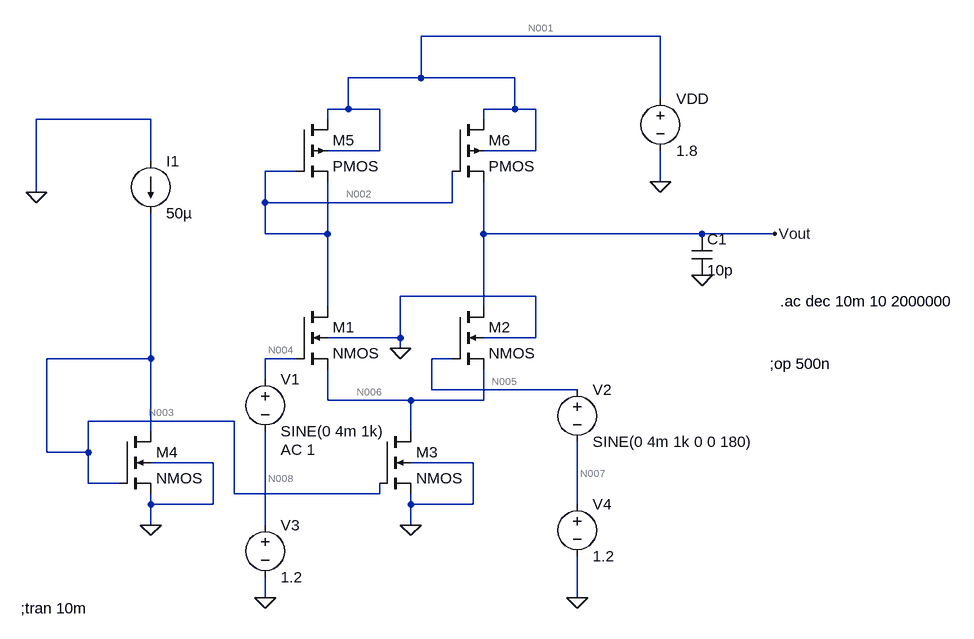
[diagram p0: schematic CMOS Differential Amplifier with Current Mirror Load.asc]
CMOS Differential Amplifier with Current Mirror Load.asc, the LTspice schematic file:
Version 4
SHEET 1 1136 680
WIRE 656 -224 288 -224
WIRE 288 -160 288 -224
WIRE 288 -160 176 -160
WIRE 432 -160 288 -160
WIRE 656 -128 656 -224
WIRE 176 -112 176 -160
WIRE 176 -112 144 -112
WIRE 224 -112 176 -112
WIRE 432 -112 432 -160
WIRE 432 -112 384 -112
WIRE 464 -112 432 -112
WIRE -128 -96 -304 -96
WIRE 144 -96 144 -112
WIRE 384 -96 384 -112
WIRE 224 -48 224 -112
WIRE 224 -48 144 -48
WIRE 464 -48 464 -112
WIRE 464 -48 384 -48
WIRE -128 -32 -128 -96
WIRE 96 -16 48 -16
WIRE 656 0 656 -48
WIRE -304 16 -304 -96
WIRE 48 32 48 -16
WIRE 336 32 336 -16
WIRE 336 32 48 32
WIRE 48 80 48 32
WIRE 144 80 144 0
WIRE 144 80 48 80
WIRE 384 80 384 0
WIRE 720 80 384 80
WIRE 832 80 720 80
WIRE 464 176 256 176
WIRE 144 192 144 80
WIRE 384 192 384 80
WIRE 256 240 256 176
WIRE 256 240 144 240
WIRE 464 240 464 176
WIRE 464 240 384 240
WIRE 256 256 256 240
WIRE -128 272 -128 48
WIRE -128 272 -288 272
WIRE 96 272 48 272
WIRE 336 272 304 272
WIRE 48 304 48 272
WIRE 304 320 304 272
WIRE 528 320 304 320
WIRE 144 336 144 288
WIRE 272 336 144 336
WIRE 384 336 384 288
WIRE 384 336 272 336
WIRE 0 368 -224 368
WIRE -128 384 -128 272
WIRE 272 384 272 336
WIRE -288 416 -288 272
WIRE -224 416 -224 368
WIRE -224 416 -288 416
WIRE -32 432 -128 432
WIRE 368 432 272 432
WIRE -224 464 -224 416
WIRE -176 464 -224 464
WIRE 0 480 0 368
WIRE 224 480 224 464
WIRE 224 480 0 480
WIRE -128 496 -128 480
WIRE -32 496 -32 432
WIRE -32 496 -128 496
WIRE 272 496 272 480
WIRE 368 496 368 432
WIRE 368 496 272 496
WIRE 528 496 528 400
WIRE -128 528 -128 496
WIRE 48 528 48 384
WIRE 272 528 272 496
WIRE 48 640 48 608
WIRE 528 640 528 576
FLAG 256 256 0
FLAG 656 0 0
FLAG -304 16 0
FLAG 528 640 0
FLAG 48 640 0
FLAG -128 528 0
FLAG 272 528 0
FLAG 720 144 0
FLAG 832 80 Vout
SYMBOL nmos4 96 192 R0
SYMATTR InstName M1
SYMATTR Value2 l=1u w=9u
SYMBOL nmos4 336 192 R0
SYMATTR InstName M2
SYMATTR Value2 l=1u w=9u
SYMBOL nmos4 224 384 R0
SYMATTR InstName M3
SYMATTR Value2 l=1u w=6u
SYMBOL nmos4 -176 384 R0
SYMATTR InstName M4
SYMATTR Value2 l=1u w=6u
SYMBOL pmos4 96 -96 R0
SYMATTR InstName M5
SYMATTR Value2 l=1u w=48u
SYMBOL pmos4 336 -96 R0
SYMATTR InstName M6
SYMATTR Value2 l=1u w=48u
SYMBOL voltage 48 288 R0
WINDOW 123 24 124 Left 2
WINDOW 39 0 0 Left 0
SYMATTR InstName V1
SYMATTR Value SINE(0 4m 1k)
SYMATTR Value2 AC 1
SYMBOL voltage 656 -144 R0
WINDOW 123 0 0 Left 0
WINDOW 39 0 0 Left 0
SYMATTR InstName VDD
SYMATTR Value 1.8
SYMBOL voltage 528 304 R0
WINDOW 123 0 0 Left 0
WINDOW 39 0 0 Left 0
SYMATTR InstName V2
SYMATTR Value SINE(0 4m 1k 0 0 180)
SYMBOL voltage 528 480 R0
WINDOW 123 0 0 Left 0
WINDOW 39 0 0 Left 0
SYMATTR InstName V4
SYMATTR Value 1.2
SYMBOL current -128 -32 R0
WINDOW 123 0 0 Left 0
WINDOW 39 0 0 Left 0
SYMATTR InstName I1
SYMATTR Value 50µ
SYMBOL voltage 48 512 R0
WINDOW 123 0 0 Left 0
WINDOW 39 0 0 Left 0
SYMATTR InstName V3
SYMATTR Value 1.2
SYMBOL cap 704 80 R0
SYMATTR InstName C1
SYMATTR Value 10p
TEXT -328 656 Left 2 !;tran 10m
TEXT 840 184 Left 2 !.ac dec 10m 10 2000000
TEXT 824 280 Left 2 !;op 500n

The netlist it stands for:
* CMOS Differential Amplifier with Current Mirror Load.asc
M1 N002 N004 N006 0 NMOS l=1u w=9u
M2 Vout N005 N006 0 NMOS l=1u w=9u
M3 N006 N003 0 0 NMOS l=1u w=6u
M4 N003 N003 0 0 NMOS l=1u w=6u
M5 N001 N002 N002 N001 PMOS l=1u w=48u
M6 N001 N002 Vout N001 PMOS l=1u w=48u
V1 N004 N008 SINE(0 4m 1k) AC 1
VDD N001 0 1.8
V2 N005 N007 SINE(0 4m 1k 0 0 180)
V4 N007 0 1.2
I1 0 N003 50µ
V3 N008 0 1.2
C1 Vout 0 10p
.model NMOS NMOS
.model PMOS PMOS
.lib standard.mos
;tran 10m
.ac dec 10m 10 2000000
;op 500n
.backanno
.end

* Results of the author's LTspice run, read from the files saved beside the schematic
* Operating Point, zero values left out:
*   V(n002) = 1.579 V
*   V(n004) = 1.2 V
*   V(n006) = 689 mV
*   V(vout) = 1.579 V
*   V(n005) = 1.2 V
*   V(n003) = 912.9 mV
*   V(n001) = 1.8 V
*   V(n008) = 1.2 V
*   V(n007) = 1.2 V
*   Id(M1) = 23.5 µA
*   Ib(M1) = -2.288 pA
*   Is(M1) = -23.5 µA
*   Id(M2) = 23.5 µA
*   Ib(M2) = -2.288 pA
*   Is(M2) = -23.5 µA
*   Id(M3) = 46.99 µA
*   Is(M3) = -46.99 µA
*   Id(M4) = 50 µA
*   Is(M4) = -50 µA
*   Id(M5) = 23.5 µA
*   Is(M5) = -23.5 µA
*   Id(M6) = 23.5 µA
*   Is(M6) = -23.5 µA
*   I(I1) = 50 µA
*   I(Vdd) = -46.99 µA
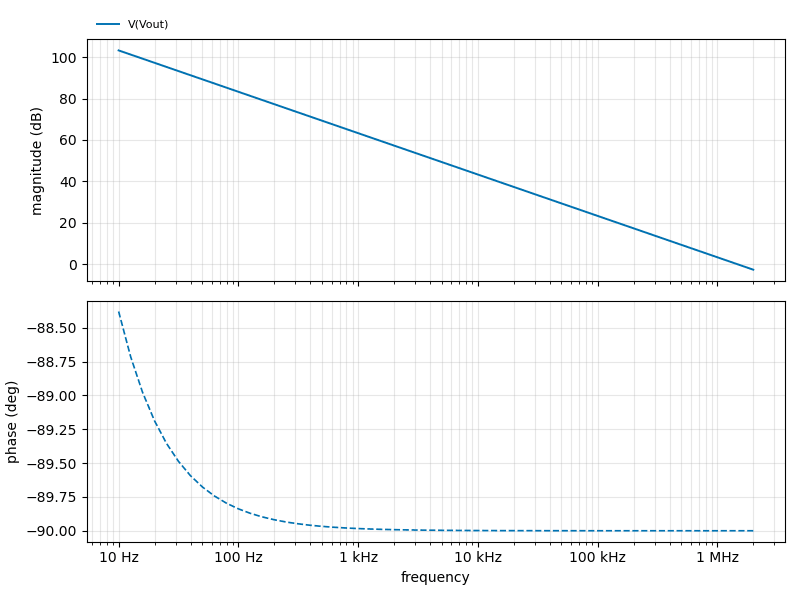
[diagram p1: AC Analysis of CMOS Differential Amplifier with Current Mirror Load.asc, plotted from the saved traces]
* AC Analysis, 1 run:
*   V(Vout): 103.31 dB at 10 Hz, -2.71 dB at 2 MHz, peak 103.31 dB at 10 Hz, 3 dB below the peak at 14.14 Hz